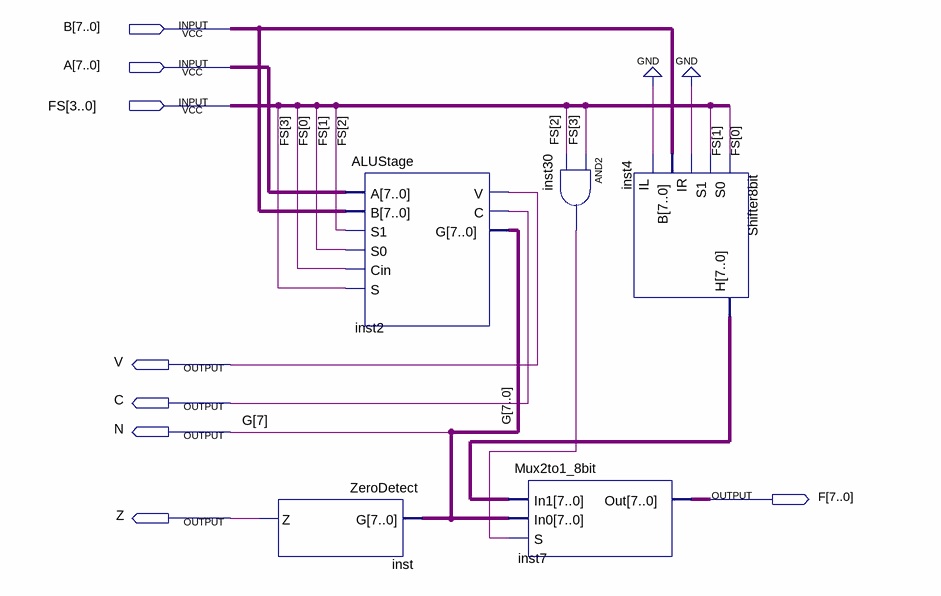
[diagram p0: schematic sheet]
// Quartus schematic FunctionUnit.bdf as structural Verilog: 5 symbols, 8 pins
module FunctionUnit (
  input  [7:0] B,
  input  [7:0] A,
  input  [3:0] FS,
  output V,
  output C,
  output N,
  output [7:0] F,
  output Z
);

  wire inst30_out;
  wire [6:0] G;
  wire [7:0] inst4_h;

  ZeroDetect inst (.G({N, G}), .Z(Z));
  ALUStage inst2 (.A(A), .B(B), .S1(FS[2]), .S0(FS[1]), .Cin(FS[0]), .S(FS[3]), .V(V), .C(C), .G({N, G}));
  Mux2to1_8bit inst7 (.In1(inst4_h), .In0({N, G}), .S(inst30_out), .Out(F));
  and inst30 (inst30_out, FS[3], FS[2]);
  Shifter8bit inst4 (.S0(FS[0]), .S1(FS[1]), .IR(1'b0), .B(B), .IL(1'b0), .H(inst4_h));

  // Other names for the same wires on the sheet: G[7] = N
endmodule
